# EAGLE schematic Thetis_RevD1_SCH (EAGLE 9.7.0)
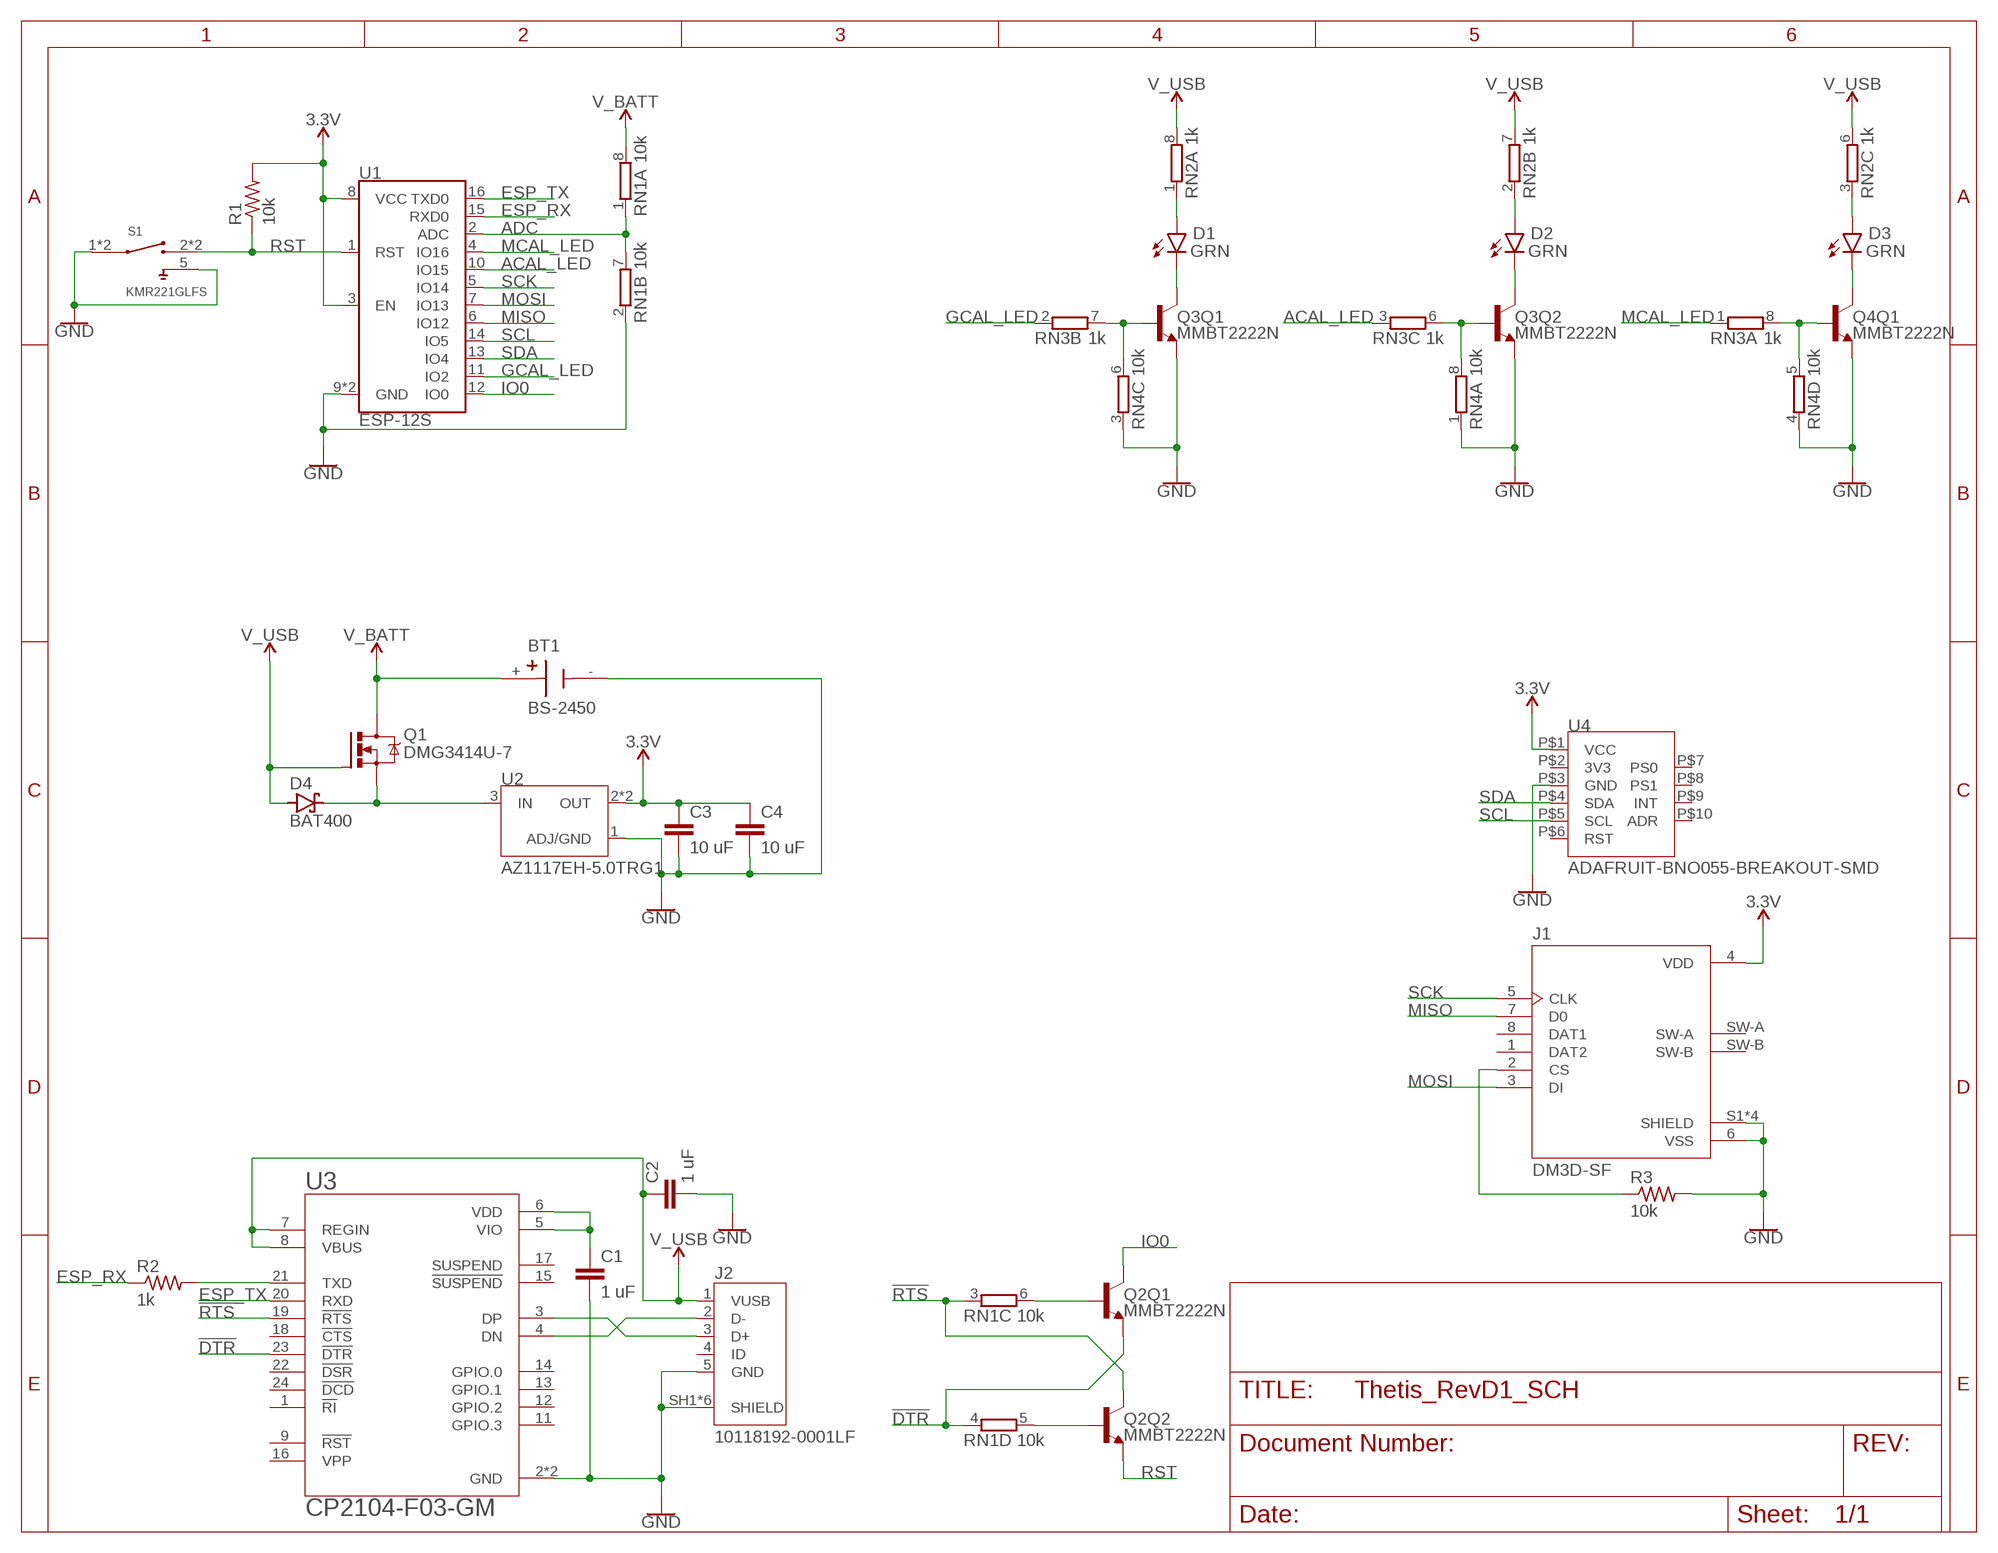
[diagram p0: schematic, sheet 1]

## Parts
BT1  BS-2450  [BAT_BS-2450]
C1  1 uF  C-EUC0603  [C0603]
C2  1 uF  C-EUC0603  [C0603]
C3  10 uF  C-EUC0603  [C0603]
C4  10 uF  C-EUC0603  [C0603]
D1  GRN  CHIP-ROUND-G_0603  [LEDC1608X65N]
D2  GRN  CHIP-ROUND-G_0603  [LEDC1608X65N]
D3  GRN  CHIP-ROUND-G_0603  [LEDC1608X65N]
D4  BAT400  BAS40  [SOT23]
J1  DM3D-SF  [HRS_DM3D-SF]
J2  10118192-0001LF  [AMPHENOL_10118192-0001LF]
Q1  DMG3414U-7  NMOSFETSOT23  [SOT23]
Q2  MMBT2222N  TRANS_NPN_DUAL-MBT3904DW1T1  [SC70-6]
Q3  MMBT2222N  TRANS_NPN_DUAL-MBT3904DW1T1  [SC70-6]
Q4  MMBT2222N  TRANS_NPN_DUAL-MBT3904DW1T1  [SC70-6]
R1  10k  R-US_R0603  [R0603]
R2  1k  R-US_R0603  [R0603]
R3  10k  R-US_R0603  [R0603]
RN1  10k  4R-NEXB28V  [EXB28V]
RN2  1k  4R-NEXB28V  [EXB28V]
RN3  1k  4R-NEXB28V  [EXB28V]
RN4  10k  4R-NEXB28V  [EXB28V]
S1  KMR221GLFS  [SW_KMR221GLFS]
U1  ESP-12S  [ESP-12S]
U2  AZ1117EH-5.0TRG1  [SOT230P700X180-4N]
U3  CP2104-F03-GM  [QFN50P400X400X80-25N]
U4  ADAFRUIT-BNO055-BREAKOUT-SMD  [ADAFRUIT-BNO055-BREAKOUT-SMD]

## Nets
3.3V: C3.1 C4.1 J1.4(VDD) R1.2 U1.3(EN) U1.8(VCC) U2.2(OUT) U2.4(OUT) U4.P$1(VCC)
!DTR: Q2.4(Q1:E) RN1.4 U3.23(!DTR)
!RTS: Q2.6(Q2:C) RN1.3 U3.19(!RTS)
ACAL_LED: RN3.3 U1.10(IO15)
ADC: RN1.1 RN1.7 U1.2(ADC)
ESP_RX: R2.1 U1.15(RXD0)
ESP_TX: U1.16(TXD0) U3.20(RXD)
GCAL_LED: RN3.2 U1.11(IO2)
GND: BT1.- C1.2 C2.2 C3.2 C4.2 J1.6(VSS) J1.S1(SHIELD) J1.S2(SHIELD) J1.S3(SHIELD) J1.S4(SHIELD) J2.5(GND) J2.SH1(SHIELD) J2.SH2(SHIELD) J2.SH3(SHIELD) J2.SH4(SHIELD) J2.SH5(SHIELD) J2.SH6(SHIELD) Q3.1(Q2:E) Q3.4(Q1:E) Q4.4(Q1:E) R3.2 RN1.2 RN4.1 RN4.3 RN4.4 S1.1 S1.4 S1.5 U1.9(GND) U1.P$1(GND) U2.1(ADJ/GND) U3.2(GND) U3.25(GND) U4.P$3(GND)
IO0: Q2.3(Q1:C) U1.12(IO0)
MCAL_LED: RN3.1 U1.4(IO16)
MISO: J1.7(D0) U1.6(IO12)
MOSI: J1.3(DI) U1.7(IO13)
N$1: J1.2(CS) R3.1
N$2: C1.1 U3.5(VIO) U3.6(VDD)
N$3: R2.2 U3.21(TXD)
N$4: J2.3(D+) U3.3(DP)
N$5: J2.2(D-) U3.4(DN)
N$6: Q3.5(Q1:B) RN3.7 RN4.6
N$7: Q2.2(Q2:B) RN1.5
N$8: D1.C Q3.3(Q1:C)
N$9: Q2.5(Q1:B) RN1.6
N$10: D1.A RN2.1
N$11: D2.A RN2.2
N$12: D2.C Q3.6(Q2:C)
N$13: D4.3(C) Q1.2(S) U2.3(IN)
N$14: Q3.2(Q2:B) RN3.6 RN4.8
N$15: Q4.5(Q1:B) RN3.8 RN4.5
N$16: D3.C Q4.3(Q1:C)
N$17: D3.A RN2.3
RST: Q2.1(Q2:E) R1.1 S1.2 S1.3 U1.1(RST)
SCK: J1.5(CLK) U1.5(IO14)
SCL: U1.14(IO5) U4.P$5(SCL)
SDA: U1.13(IO4) U4.P$4(SDA)
V_BATT: BT1.+ Q1.3(D) RN1.8
V_USB: C2.1 D4.1(A) J2.1(VUSB) Q1.1(G) RN2.6 RN2.7 RN2.8 U3.7(REGIN) U3.8(VBUS)
Unconnected: J1.1(DAT2) J1.8(DAT1) J1.SW-A J1.SW-B J2.4(ID) Q4.1(Q2:E) Q4.2(Q2:B) Q4.6(Q2:C) RN2.4 RN2.5 RN3.4 RN3.5 RN4.2 RN4.7 U3.1(!RI) U3.9(!RST!) U3.11(GPIO.3) U3.12(GPIO.2) U3.13(GPIO.1) U3.14(GPIO.0) U3.15(!SUSPEND!) U3.16(VPP) U3.17(SUSPEND) U3.18(!CTS) U3.22(!DSR) U3.24(!DCD) U4.P$6(RST) U4.P$7(PS0) U4.P$8(PS1) U4.P$9(INT) U4.P$10(ADR)

## Power pins joined to a net without a drawn wire
3V3: U4.P$2(3V3)

## Library data of the parts
BT1 = BS-2450:BS-2450: Battery Holder (Open) Coin, 24.5mm 1 Cell PC Pin; AVAILABILITY: Unavailable; DESCRIPTION: Battery Holder _Open_ Coin, 24.5mm 1 Cell PC Pin; MF: MPD; MP: BS-2450; PACKAGE: Non-Standard MPD; PRICE: None
C1-C4 = rcl:C-EU: CAPACITOR, European symbol; SPICEPREFIX: C
D1-D3 = LED:CHIP-ROUND-G; CATEGORY: LED; COLOR: GREEN; DESCRIPTION: CHIP LED ROUND; SUB-CATEGORY: CHIP; TYPE: ROUND_TOP
D4 = diode:BAS40: Silicon Schottky Diodes General-purpose diode for high-speed switching
J1 = DM3D-SF:DM3D-SF: Right Angle SMT Top Board Mount Push-Pull No Ejection MicroSD Connector; MANUFACTURER: Hirose; MAXIMUM_PACKAGE_HEIGHT: 1.55mm; PARTREV: 2017.1; STANDARD: Manufacturer Recommendations
J2 = MicroUSB:10118192-0001LF: Single Port 5 Contact Horizontal Right Angle Shielded Micro B USB 2.0 Connector; MANUFACTURER: Amphenol; PARTREV: B; STANDARD: Manufacturer Recommendation
Q1 = Transistor:NMOSFET: N-Channel MOSFET - Generic; CATEGORY: Transistor; SUB-CATEGORY: MOSFET; TYPE: N-Channel; VALUE: NMOSFET
Q2-Q4 = SparkFun-DiscreteSemi-Poseidon-Edit:TRANS_NPN_DUAL: Dual NPN Transistors in Single Package The MBT3904W1 puts two general purpose 3904 NPN transistors in a single package. Datasheet <http://www.onsemi.com/pub_link/Collateral/MBT3904DW1T1-D.PDF> SparkFun Products: SparkFun ESP32 Thing <https://www.sparkfun.com/products/13907>; PROD_ID: TRANS-13337
R1-R3 = rcl:R-US_: RESISTOR, American symbol; SPICEPREFIX: R
RN1-RN4 = resistor-dil-Poseidon-Edit:4R-N: Array Chip Resistor Source: RS Component / Phycomp; OC_FARNELL: unknown; OC_NEWARK: unknown
S1 = KMR221GLFS:KMR221GLFS: Switch Tactile N.O. SPST Button Gull Wing 0.05A 32VDC 1VA 200000Cycles 2N SMD Automotive T/R; MANUFACTURER: CnK
U1 = ESP-12S:ESP-12S: AI-Thinker ESP-12S ESP-12S WiFi module is developed by AI-Thinker Co.,Ltd, core processor ESP8266 in smaller sizes of the module encapsulates Tensilica L106 integrates industry-leading ultra low power 32-bit MCU micro, with the 16-bit short mode, clock speed support 80 MHz, 160 MHz, supports the RTOS, integrated Wi-Fi MAC/BB/RF/PA/LNA, on-board antennas.; PROD_ID: IC-14115
U2 = AZ1117EH-5.0TRG1:AZ1117EH-5.0TRG1; ARROW_ELECTRONICS-PURCHASE-URL: https://snapeda.com/shop?store=Arrow+Electronics&id=482930; AVAILABILITY: Good; DESCRIPTION: Linear Voltage Regulator IC 1 Output 1A SOT-223; DIGIKEY-PURCHASE-URL: https://snapeda.com/shop?store=DigiKey&id=482930; MF: Diodes Inc.; MOUSER-PURCHASE-URL: https://snapeda.com/shop?store=Mouser&id=482930; MP: AZ1117EH-5.0TRG1; PACKAGE: SOT-223 Diodes Inc.; PRICE: None
U3 = CP2104:CP2104: Silabs CP2104 USB to UART Bridge; MANUFACTORER: Silicon Labs; PARTREV: 1.0; STANDERD: IPC-7351B
U4 = EVE-ECAD-Library:ADAFRUIT-BNO055-BREAKOUT